# EAGLE board bias_board (EAGLE 6.4), part 1 of 2
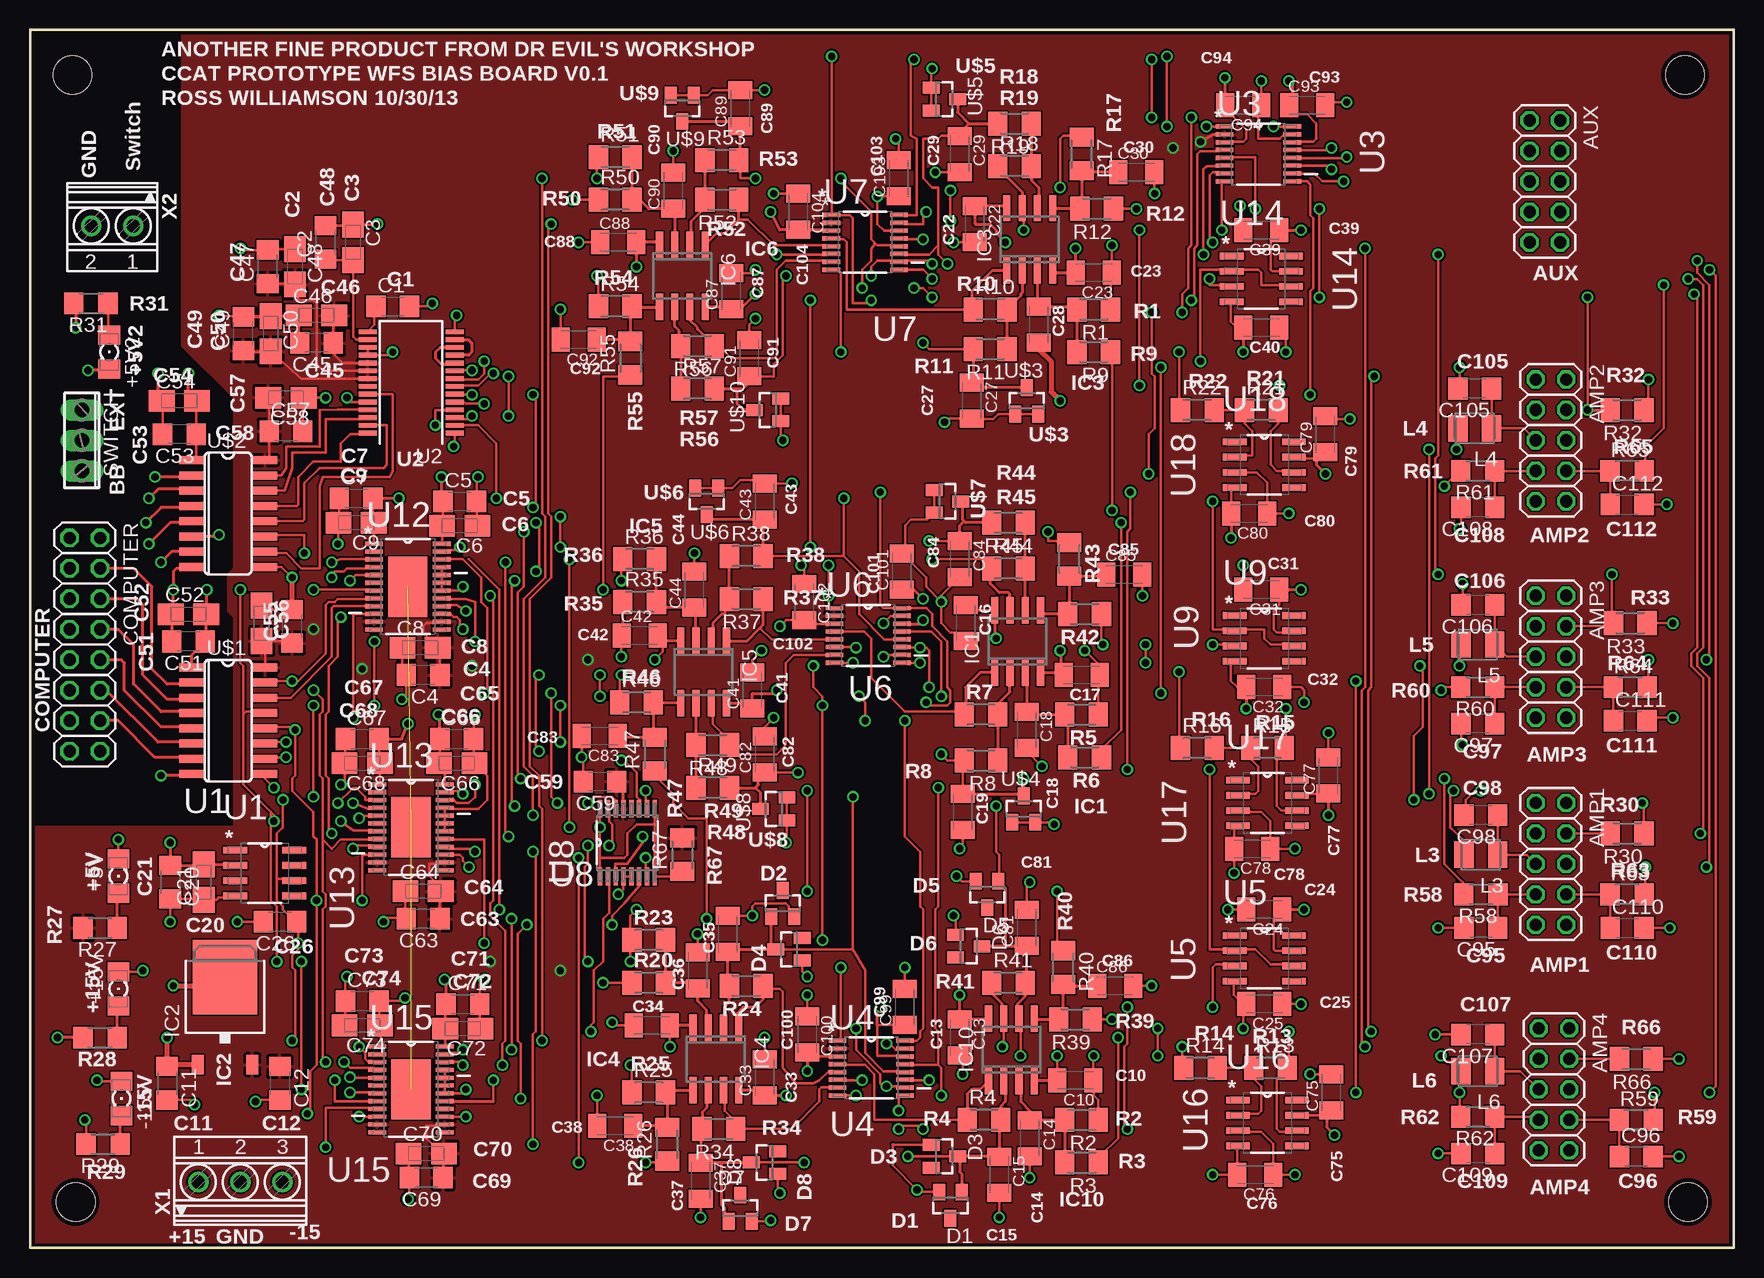
[diagram p5: board, top side]
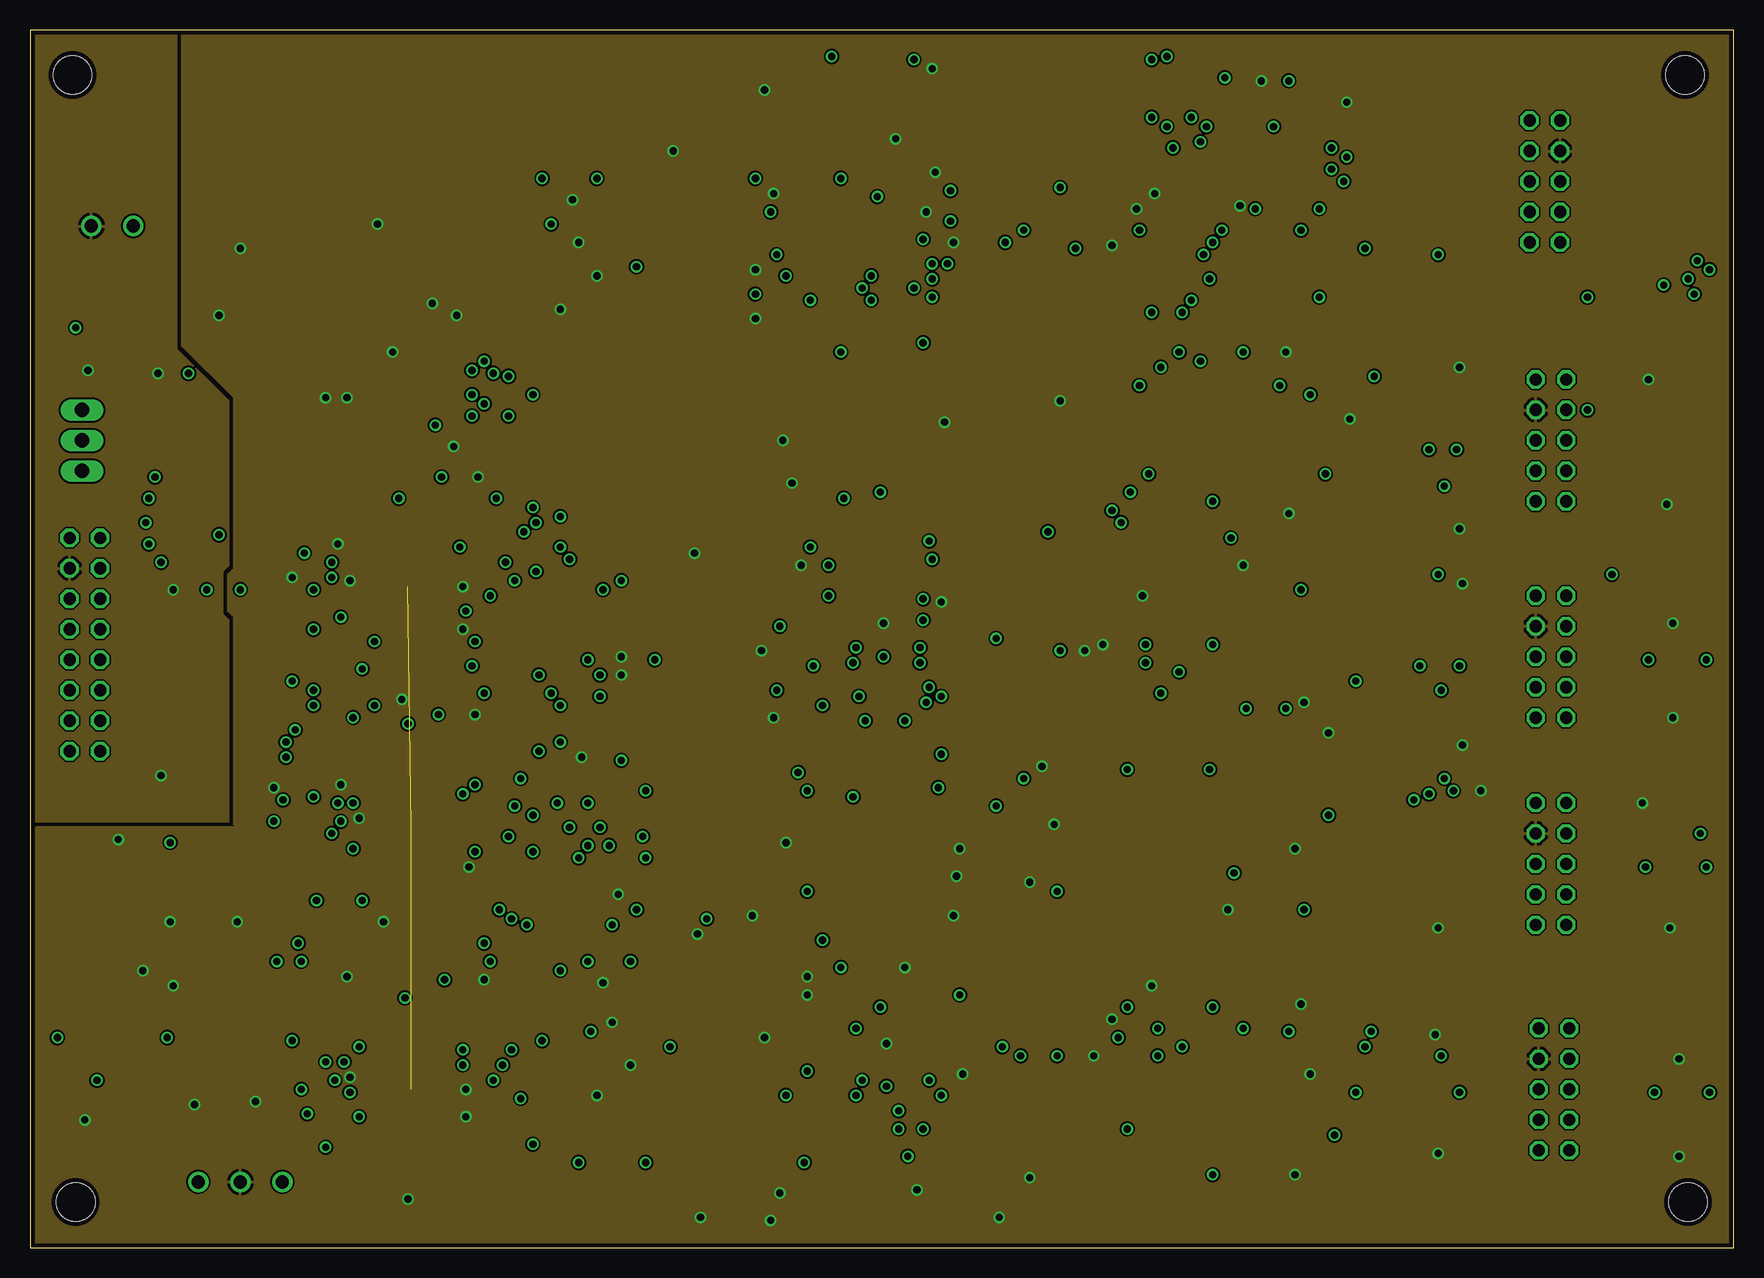
[diagram p6: board, inner layer GND]
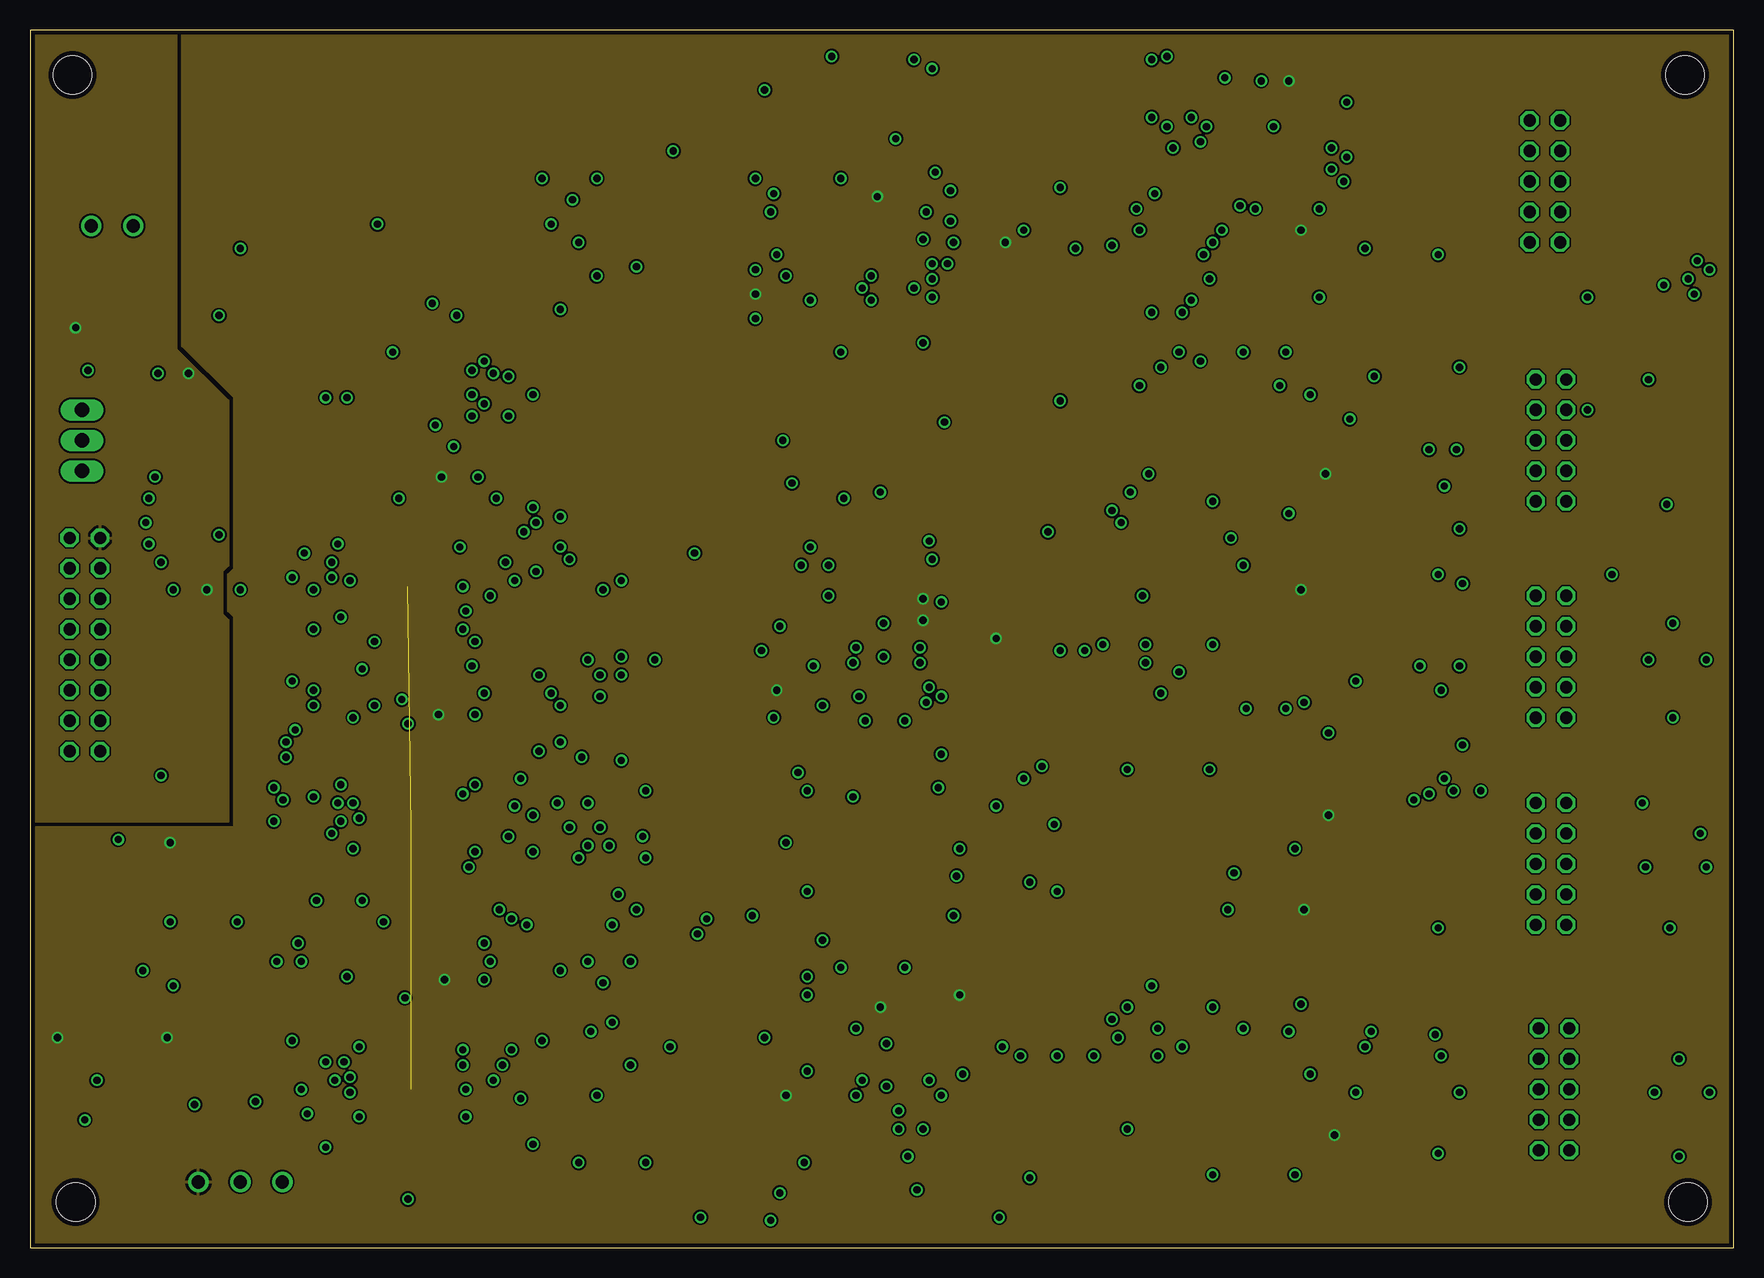
[diagram p7: board, inner layer VCC]
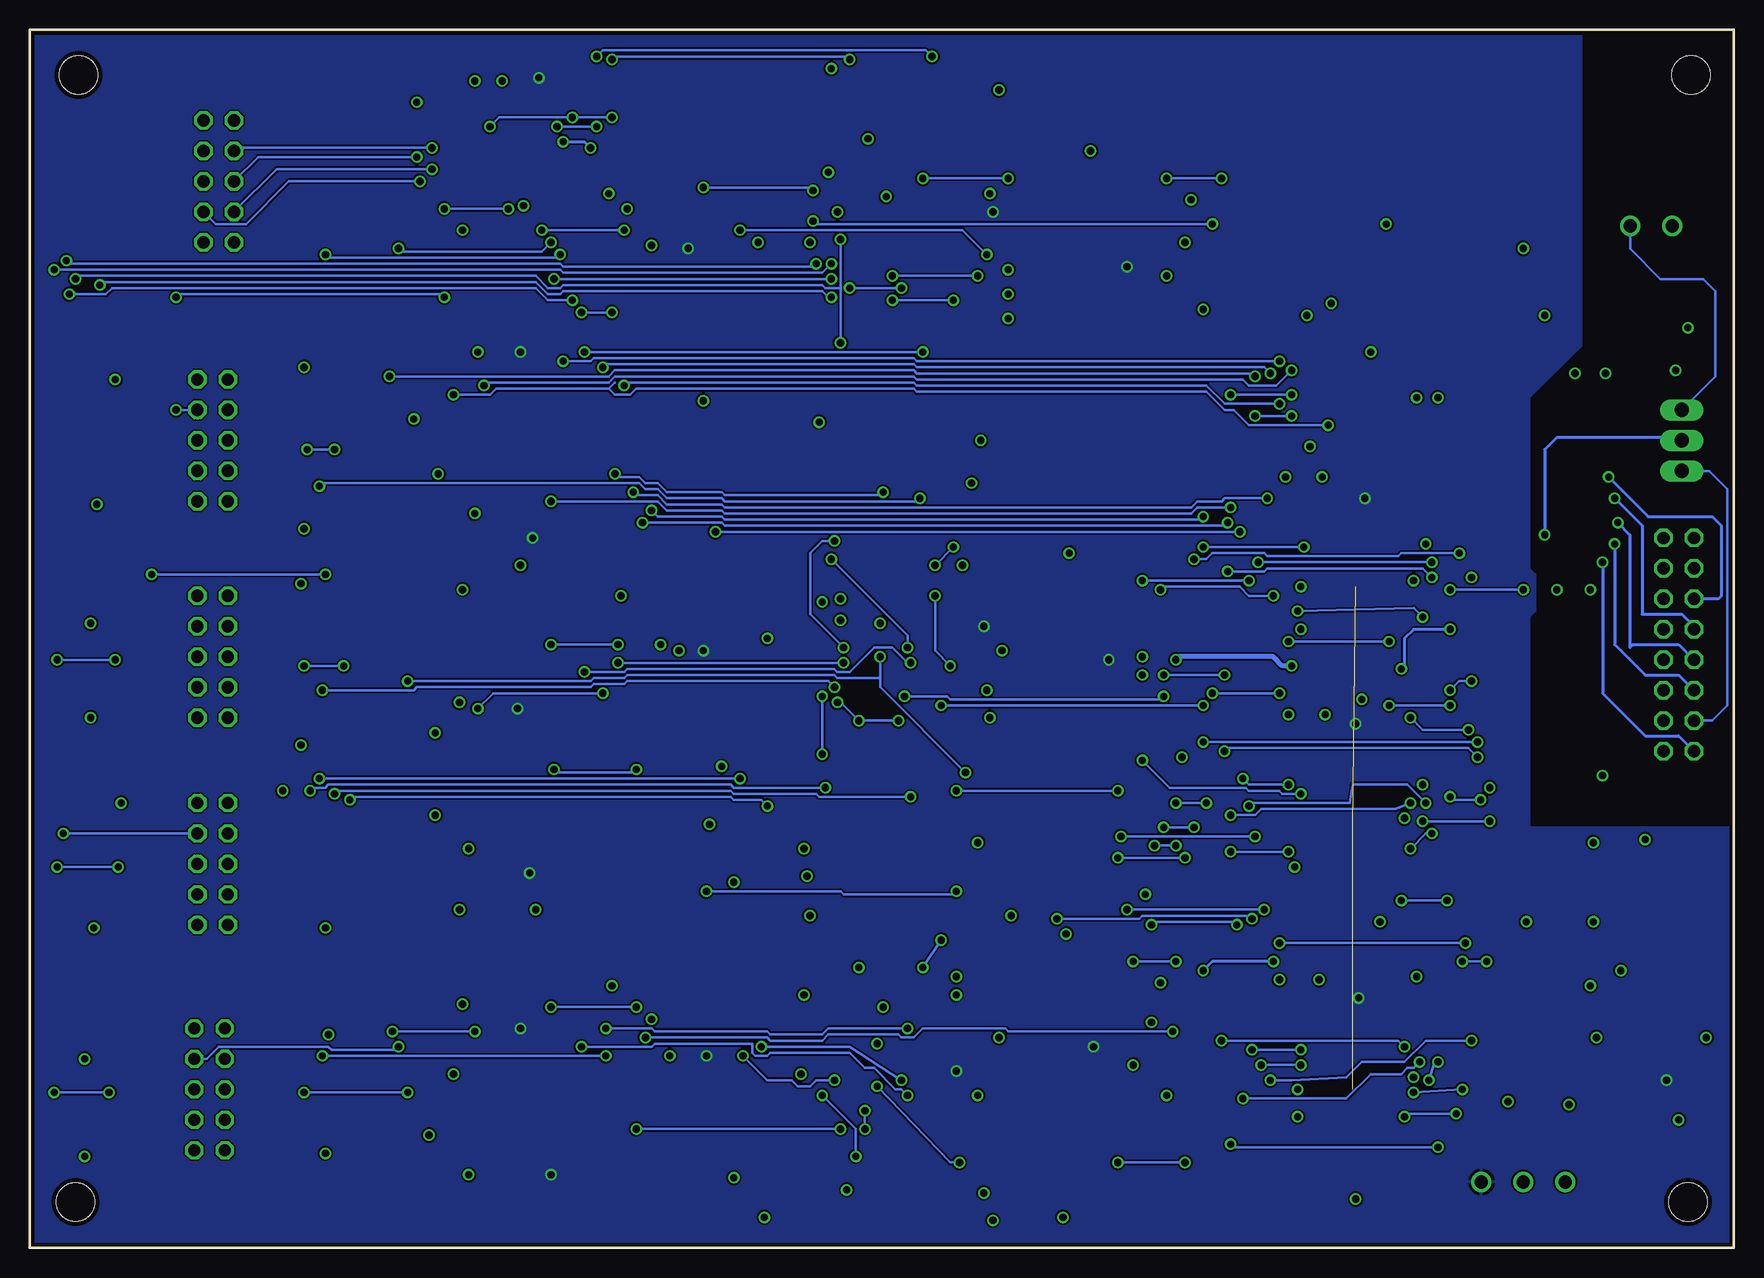
[diagram p8: board, bottom side, seen from below]

Size 141.97 x 101.52 mm. Coordinates in mm from the lower left corner, seen from the top.
Outline: 0,0 141.97,0 141.97,101.52 0,101.52 0,0
Copper layers (1*2+15*16): Top 0.0356mm / dielectric 1.5011mm / GND 0.0356mm / dielectric 0.1499mm / VCC 0.0356mm / dielectric 0.2007mm / Bottom 0.0356mm
Design rules "LaenPCBOrder *": minimum track width 6mil, minimum drill 13mil, track to track 6mil, track to pad 6mil, pad to pad 6mil, via to via 6mil, smd to smd 6mil, copper to edge 15mil, drill to drill 6mil, minimum pad ring 7mil, minimum via ring 7mil, stop-mask expansion 4mil, vias tented up to drill 0mil, thermal gap 10mil
Holes 3.2 mm at 3.81,3.81 3.56,97.79 137.92,97.79 138.18,3.81

## Footprints (pad centres in the part's own frame; a part is rotated, then mirrored left to right if it is on the bottom)
1206 = smd 1.6 x 1.803: A -1.422,0; C 1.422,0
2X05 = drill 1.016 octagon: 1 -5.08,-1.27; 2 -5.08,1.27; 3 -2.54,-1.27; 4 -2.54,1.27; 5 0,-1.27; 6 0,1.27; 7 2.54,-1.27; 8 2.54,1.27; 9 5.08,-1.27; 10 5.08,1.27
C1206 = smd 1.6 x 1.8: 1 -1.4,0; 2 1.4,0
A/3216-18W = smd 2.15 x 1.8: + 1.475,0; - -1.475,0
C1206K = smd 1.5 x 2: 1 -1.5,0; 2 1.5,0
2X08 = drill 1.016 octagon: 1 -8.89,-1.27; 2 -8.89,1.27; 3 -6.35,-1.27; 4 -6.35,1.27; 5 -3.81,-1.27; 6 -3.81,1.27; 7 -1.27,-1.27; 8 -1.27,1.27; 9 1.27,-1.27; 10 1.27,1.27; 11 3.81,-1.27; 12 3.81,1.27; 13 6.35,-1.27; 14 6.35,1.27; 15 8.89,-1.27; 16 8.89,1.27
SOT23 = smd 1 x 1.4: 1 -0.95,-1.1; 2 0.95,-1.1; 3 0,1.1
SO8 = smd 0.6 x 2.2: 1 -1.905,-2.6; 2 -0.635,-2.6; 3 0.635,-2.6; 4 1.905,-2.6; 5 1.905,2.6; 6 0.635,2.6; 7 -0.635,2.6; 8 -1.905,2.6
TO252 = smd 1 x 1.6: 1 -2.28,-4.8; 2 2.28,-4.8 | smd 5.4 x 6.2: 3 0,2.5
L3225M = smd 1.6 x 2.2: 1 -1.4,0; 2 1.4,0
M1206 = smd 1.6 x 2: 1 -1.4,0; 2 1.4,0
R1206 = smd 1.6 x 1.803: 1 -1.422,0; 2 1.422,0
3POL254 = drill 1.2 long: 1 -2.54,0; 2 0,0; 3 2.54,0
SOIC127P600X175-8N = smd 1.981 x 0.559: 1 -2.464,1.905; 2 -2.464,0.635; 3 -2.464,-0.635; 4 -2.464,-1.905; 5 2.464,-1.905; 6 2.464,-0.635; 7 2.464,0.635; 8 2.464,1.905
SSOP28 = smd 0.4 x 1.5: 1 -4.225,-3.625; 2 -3.575,-3.625; 3 -2.925,-3.625; 4 -2.275,-3.625; 5 -1.625,-3.625; 6 -0.975,-3.625; 7 -0.325,-3.625; 8 0.325,-3.625; 9 0.975,-3.625; 10 1.625,-3.625; 11 2.275,-3.625; 12 2.925,-3.625; 13 3.575,-3.625; 14 4.225,-3.625; 15 4.225,3.625; 16 3.575,3.625; 17 2.925,3.625; 18 2.275,3.625; 19 1.625,3.625; 20 0.975,3.625; 21 0.325,3.625; 22 -0.325,3.625; 23 -0.975,3.625; 24 -1.625,3.625; 25 -2.275,3.625; 26 -2.925,3.625; 27 -3.575,3.625; 28 -4.225,3.625
SOP65P640X120-16N = smd 1.473 x 0.356: 1 -2.819,2.286; 2 -2.819,1.626; 3 -2.819,0.965; 4 -2.819,0.33; 5 -2.819,-0.33; 6 -2.819,-0.965; 7 -2.819,-1.626; 8 -2.819,-2.286; 9 2.819,-2.286; 10 2.819,-1.626; 11 2.819,-0.965; 12 2.819,-0.33; 13 2.819,0.33; 14 2.819,0.965; 15 2.819,1.626; 16 2.819,2.286
SOP65P640X120-25N = smd 1.473 x 0.356: 1 -2.819,3.581; 2 -2.819,2.921; 3 -2.819,2.286; 4 -2.819,1.626; 5 -2.819,0.965; 6 -2.819,0.33; 7 -2.819,-0.33; 8 -2.819,-0.965; 9 -2.819,-1.626; 10 -2.819,-2.286; 11 -2.819,-2.921; 12 -2.819,-3.581; 13 2.819,-3.581; 14 2.819,-2.921; 15 2.819,-2.286; 16 2.819,-1.626; 17 2.819,-0.965; 18 2.819,-0.33; 19 2.819,0.33; 20 2.819,0.965; 21 2.819,1.626; 22 2.819,2.286; 23 2.819,2.921; 24 2.819,3.581 | smd 3.251 x 5.029: 25 0,0
SO16 = smd 0.66 x 2.032: 1 -4.445,-3.073; 2 -3.175,-3.073; 3 -1.905,-3.073; 4 -0.635,-3.073; 5 0.635,-3.073; 6 1.905,-3.073; 7 3.175,-3.073; 8 4.445,-3.073; 9 4.445,3.073; 10 3.175,3.073; 11 1.905,3.073; 12 0.635,3.073; 13 -0.635,3.073; 14 -1.905,3.073; 15 -3.175,3.073; 16 -4.445,3.073
1751251 = drill 1.1 pad 1.7: 1 -3.5,-0.1; 2 0,-0.1; 3 3.5,-0.1
1751248 = drill 1.1 pad 1.7: 1 -1.75,-0.1; 2 1.75,-0.1

## Placement (x,y rotation side)
+5V  Green  [1206]  7.37,30.99 90 top
+5V2  Green  [1206]  6.6,74.68 270 top
+15V  Green  [1206]  7.37,21.59 90 top
-15V  Green  [1206]  7.62,12.45 270 top
AMP1  [2X05]  126.75,32 270 top
AMP2  [2X05]  126.75,67.31 270 top
AMP3  [2X05]  126.75,49.28 270 top
AMP4  [2X05]  127,13.21 270 top
AUX  [2X05]  126.24,88.9 270 top
C1  1uF  [C1206]  30.23,78.49 0 top
C2  1uF  [C1206]  24.64,83.82 90 top
C3  10uF  [A/3216-18W]  26.92,83.82 270 top
C4  0.1uf  [C1206]  32.77,47.75 180 top
C5  0.1uf  [C1206]  35.81,62.23 0 top
C6  4.7uf  [A/3216-18W]  35.81,60.2 180 top
C7  0.1uf  [C1206]  27.18,62.48 0 top
C8  4.7uf  [A/3216-18W]  32.51,50.04 0 top
C9  4.7uf  [A/3216-18W]  27.18,60.45 180 top
C10  100nF  [C1206K]  87.12,13.97 180 top
C11  0.3uf  [C1206]  11.43,13.72 270 top
C12  0.1uf  [C1206]  20.83,13.72 270 top
C13  100nF  [C1206K]  77.47,17.53 270 top
C14  33uF  [C1206K]  83.31,9.14 270 top
C15  1uF  [C1206K]  80.77,6.1 270 top
C16  100nF  [C1206K]  77.98,52.07 270 top
C17  100nF  [C1206K]  87.63,47.75 180 top
C18  33uF  [C1206K]  83.06,43.18 270 top
C19  1uF  [C1206K]  77.72,36.32 270 top
C20  0.1uf  [C1206]  11.68,30.48 270 top
C21  10uF  [A/3216-18W]  14.48,30.48 90 top
C22  100nF  [C1206K]  78.74,85.34 270 top
C23  100nF  [C1206K]  88.65,81.28 180 top
C24  100nF  [C1206K]  102.87,28.19 180 top
C25  100nF  [C1206K]  102.87,20.32 180 top
C26  0.1uf  [C1206]  20.83,27.18 180 top
C27  1uF  [C1206K]  78.49,70.61 270 top
C28  33uF  [C1206K]  84.07,76.96 270 top
C29  1uF  [C1206K]  77.47,91.19 270 top
C30  33uF  [C1206K]  92.2,89.66 0 top
C31  100nF  [C1206K]  102.62,54.86 180 top
C32  100nF  [C1206K]  102.87,46.74 180 top
C33  100nF  [C1206K]  61.21,14.22 90 top
C34  100nF  [C1206K]  51.82,18.54 0 top
C35  1uF  [C1206K]  58.17,26.16 90 top
C36  33uF  [C1206K]  55.63,23.11 90 top
C37  1uF  [C1206K]  55.88,5.59 270 top
C38  33uF  [C1206K]  48.77,10.16 180 top
C39  100nF  [C1206K]  102.62,84.84 180 top
C40  100nF  [C1206K]  102.62,76.71 180 top
C41  100nF  [C1206K]  60.2,46.48 90 top
C42  100nF  [C1206K]  50.8,51.05 0 top
C43  1uF  [C1206K]  61.21,62.23 90 top
C44  33uF  [C1206K]  55.37,54.86 90 top
C45  0.1uf  [C1206]  23.88,75.44 180 top
C46  10uf  [A/3216-18W]  23.88,77.72 0 top
C47  0.1uf  [C1206]  19.81,81.79 90 top
C48  10uf  [A/3216-18W]  22.1,81.79 270 top
C49  0.1uf  [C1206]  17.78,76.2 90 top
C50  10uf  [A/3216-18W]  20.07,76.2 270 top
C51  0.1uf  [C1206]  13.21,50.55 180 top
C52  4.7uf  [A/3216-18W]  13.21,52.83 0 top
C53  0.1uf  [C1206]  12.45,67.82 180 top
C54  4.7uf  [A/3216-18W]  12.45,70.61 0 top
C55  0.1uf  [C1206]  21.84,51.82 90 top
C56  4.7uf  [A/3216-18W]  19.3,52.07 270 top
C57  0.1uf  [C1206]  21.34,68.07 0 top
C58  4.7uf  [A/3216-18W]  21.34,70.87 180 top
C59  0.1uf  [C1206]  47.5,38.86 180 top
C63  0.1uf  [C1206]  32.77,27.43 180 top
C64  4.7uf  [A/3216-18W]  32.77,29.72 0 top
C65  0.1uf  [C1206]  35.56,42.42 0 top
C66  4.7uf  [A/3216-18W]  35.56,40.39 180 top
C67  0.1uf  [C1206]  27.69,42.42 0 top
C68  4.7uf  [A/3216-18W]  27.69,40.39 180 top
C69  0.1uf  [C1206]  33.02,5.84 180 top
C70  4.7uf  [A/3216-18W]  33.02,7.87 0 top
C71  0.1uf  [C1206]  36.07,20.32 0 top
C72  4.7uf  [A/3216-18W]  36.07,18.29 180 top
C73  0.1uf  [C1206]  27.69,20.57 0 top
C74  4.7uf  [A/3216-18W]  27.69,18.54 180 top
C75  100nF  [C1206K]  108.46,12.95 90 top
C76  100nF  [C1206K]  102.11,6.1 180 top
C77  100nF  [C1206K]  108.2,39.37 90 top
C78  100nF  [C1206K]  101.85,33.27 180 top
C79  100nF  [C1206K]  107.95,67.82 90 top
C80  100nF  [C1206K]  101.6,61.21 180 top
C81  1uF  [C1206K]  83.06,26.67 90 top
C82  1uF  [C1206K]  61.21,41.15 90 top
C83  33uF  [C1206K]  47.5,42.67 180 top
C84  1uF  [C1206K]  77.47,57.4 270 top
C85  33uF  [C1206K]  91.19,56.13 0 top
C86  33uF  [C1206K]  90.42,21.84 0 top
C87  100nF  [C1206K]  58.42,79.76 90 top
C88  100nF  [C1206K]  49.02,83.82 0 top
C89  1uF  [C1206K]  59.18,95 90 top
C90  33uF  [C1206K]  53.59,88.14 90 top
C91  1uF  [C1206K]  59.94,74.17 90 top
C92  33uF  [C1206K]  45.72,75.69 180 top
C93  100nF  [C1206K]  106.43,95.25 0 top
C94  100nF  [C1206K]  101.09,95.25 180 top
C95  33nF  [C1206]  120.9,26.67 180 top
C96  33nF  [C1206]  133.86,7.62 0 top
C97  33nF  [C1206]  120.65,43.69 180 top
C98  33nF  [C1206]  120.9,36.07 180 top
C99  100nF  [C1206K]  72.9,20.07 90 top
C100  100nF  [C1206K]  64.77,17.78 270 top
C101  100nF  [C1206K]  72.64,56.39 90 top
C102  100nF  [C1206K]  64.52,53.85 270 top
C103  100nF  [C1206K]  72.39,89.15 90 top
C104  100nF  [C1206K]  64.01,86.36 270 top
C105  33nF  [C1206]  120.4,71.63 180 top
C106  33nF  [C1206]  120.65,53.59 180 top
C107  33nF  [C1206]  120.65,17.78 180 top
C108  33nF  [C1206]  120.65,61.72 180 top
C109  33nF  [C1206]  120.65,7.87 180 top
C110  33nF  [C1206]  133.1,26.67 0 top
C111  33nF  [C1206]  133.35,43.94 0 top
C112  33nF  [C1206]  133.1,61.98 0 top
COMPUTER  [2X08]  4.57,50.29 270 top
D1  BAV23S  [SOT23]  76.71,3.56 180 top
D2  BAV23S  [SOT23]  62.74,28.7 0 top
D3  BAT54  [SOT23]  76.2,7.62 270 top
D4  BAT54  [SOT23]  63.25,24.89 90 top
D5  BAV23S  [SOT23]  79.76,29.46 180 top
D6  BAT54  [SOT23]  78.23,25.15 270 top
D7  BAV23S  [SOT23]  59.18,3.3 0 top
D8  BAT54  [SOT23]  61.21,7.11 90 top
IC1  AD8066R  [SO8]  82.3,50.55 0 top
IC2  7805DT  [TO252]  16.26,20.07 0 top
IC3  AD8066R  [SO8]  83.31,84.07 0 top
IC4  AD8066R  [SO8]  57.15,15.75 180 top
IC5  AD8066R  [SO8]  56.13,48.01 180 top
IC6  AD8066R  [SO8]  54.36,81.03 180 top
IC10  AD8066R  [SO8]  81.79,16.51 0 top
L3  150nH  [L3225M]  120.9,32.77 180 top
L4  150nH  [L3225M]  120.4,68.33 180 top
L5  150nH  [L3225M]  120.65,50.29 180 top
L6  150nH  [L3225M]  120.65,14.73 180 top
R1  100k  [M1206]  88.65,78.23 180 top
R2  43K  [M1206]  87.63,10.67 180 top
R3  100k  [M1206]  87.63,7.11 180 top
R4  2  [M1206]  79.5,10.67 0 top
R5  100k  [M1206]  87.63,44.45 180 top
R6  158k  [M1206]  87.88,40.89 180 top
R7  2  [M1206]  79.25,44.45 0 top
R8  0  [M1206]  79.25,40.64 180 top
R9  158k  [M1206]  88.65,74.68 180 top
R10  2  [M1206]  80.01,78.23 0 top
R11  0  [M1206]  80.01,74.93 180 top
R12  100k  [M1206]  88.9,86.61 180 top
R13  10k  [M1206]  103.38,14.99 0 top
R14  1k  [M1206]  97.54,14.99 0 top
R15  10k  [M1206]  103.12,41.66 0 top
R16  1k  [M1206]  97.28,41.66 0 top
R17  158k  [M1206]  87.63,91.19 270 top
R18  2  [M1206]  82.04,90.17 0 top
R19  0  [M1206]  82.04,93.73 180 top
R20  43K  [M1206]  51.56,22.1 0 top
R21  10k  [M1206]  102.62,69.85 0 top
R22  1k  [M1206]  97.28,69.85 0 top
R23  100k  [M1206]  51.56,25.65 0 top
R24  2  [M1206]  59.69,21.84 180 top
R25  43K  [M1206]  51.56,12.95 0 top
R26  100k  [M1206]  53.09,8.64 90 top
R27  145  [R1206]  5.84,26.67 180 top
R28  640  [R1206]  5.84,17.53 180 top
R29  640  [R1206]  6.1,8.64 180 top
R30  0  [M1206]  133.1,34.54 180 top
R31  145  [R1206]  5.08,78.74 180 top
R32  0  [M1206]  133.1,69.85 180 top
R33  0  [M1206]  133.35,52.07 180 top
R34  2  [M1206]  57.4,9.91 180 top
R35  100k  [M1206]  50.8,53.85 0 top
R36  158k  [M1206]  50.8,57.4 0 top
R37  2  [M1206]  59.69,54.1 180 top
R38  0  [M1206]  59.69,57.66 0 top
R39  43K  [M1206]  87.12,19.05 180 top
R40  100k  [M1206]  86.11,23.37 270 top
R41  2  [M1206]  81.53,22.1 0 top
R42  100k  [M1206]  87.88,52.83 180 top
R43  158k  [M1206]  86.61,57.4 270 top
R44  2  [M1206]  81.53,56.64 0 top
R45  0  [M1206]  81.53,60.45 180 top
R46  100k  [M1206]  50.55,45.47 0 top
R47  158k  [M1206]  52.07,41.15 90 top
R48  2  [M1206]  56.9,41.91 180 top
R49  0  [M1206]  56.9,38.35 0 top
R50  100k  [M1206]  48.77,87.38 0 top
R51  158k  [M1206]  48.77,90.93 0 top
R52  2  [M1206]  57.66,87.38 180 top
R53  0  [M1206]  57.66,90.68 0 top
R54  100k  [M1206]  48.77,78.49 0 top
R55  158k  [M1206]  50.04,74.17 90 top
R56  2  [M1206]  55.63,75.18 180 top
R57  0  [M1206]  55.63,71.63 0 top
R58  49  [R1206]  120.9,29.46 180 top
R59  49  [R1206]  133.86,10.67 0 top
R60  49  [R1206]  120.65,46.74 180 top
R61  49  [R1206]  120.65,64.77 180 top
R62  49  [R1206]  120.65,10.92 180 top
R63  49  [R1206]  133.1,29.46 0 top
R64  49  [R1206]  133.35,46.74 0 top
R65  49  [R1206]  133.1,64.77 0 top
R66  0  [M1206]  133.86,15.75 180 top
R67  0  [M1206]  54.36,32.77 90 top
SWITCH  [3POL254]  4.32,67.31 270 top
U1  ADR441BRZ  [SOIC127P600X175-8N]  19.56,31.24 0 top
U2  LTC1858  [SSOP28]  31.75,72.14 90 top
U3  ADG5409BRUZ  [SOP65P640X120-16N]  102.36,91.19 0 top
U4  ADG5409BRUZ  [SOP65P640X120-16N]  70.1,14.99 0 top
U5  OP177FSZ  [SOIC127P600X175-8N]  102.87,24.13 0 top
U6  ADG5409BRUZ  [SOP65P640X120-16N]  69.85,51.05 0 top
U7  ADG5409BRUZ  [SOP65P640X120-16N]  69.6,83.82 0 top
U8  ADG612YRUZ  [SOP65P640X120-16N]  49.78,33.78 90 top
U9  OP177FSZ  [SOIC127P600X175-8N]  102.87,50.8 0 top
U12  AD5734RBREZ  [SOP65P640X120-25N]  31.5,55.12 0 top
U13  AD5734RBREZ  [SOP65P640X120-25N]  31.75,35.05 0 top
U14  OP177FSZ  [SOIC127P600X175-8N]  102.62,80.77 0 top
U15  AD5734RBREZ  [SOP65P640X120-25N]  31.75,13.21 0 top
U16  OP177FSZ  [SOIC127P600X175-8N]  103.12,10.41 0 top
U17  OP177FSZ  [SOIC127P600X175-8N]  103.12,37.08 0 top
U18  OP177FSZ  [SOIC127P600X175-8N]  102.87,65.28 0 top
U$1  [SO16]  16.51,43.94 270 top
U$2  SI8661IS1  [SO16]  16.51,61.21 270 top
U$3  BAV99  [SOT23]  83.06,70.61 0 top
U$4  BAV99  [SOT23]  82.8,36.58 0 top
U$5  BAV99  [SOT23]  76.2,95.76 270 top
U$6  BAV99  [SOT23]  56.39,62.23 180 top
U$7  BAV99  [SOT23]  76.45,62.23 270 top
U$8  BAV99  [SOT23]  61.98,36.58 90 top
U$9  BAV99  [SOT23]  54.36,95 180 top
U$10  BAV99  [SOT23]  61.47,69.85 90 top
X1  1751251  [1751251]  17.53,5.59 0 top
X2  1751248  [1751248]  6.86,85.09 180 top